# Altium schematic sheet MCU.SchDoc
size B
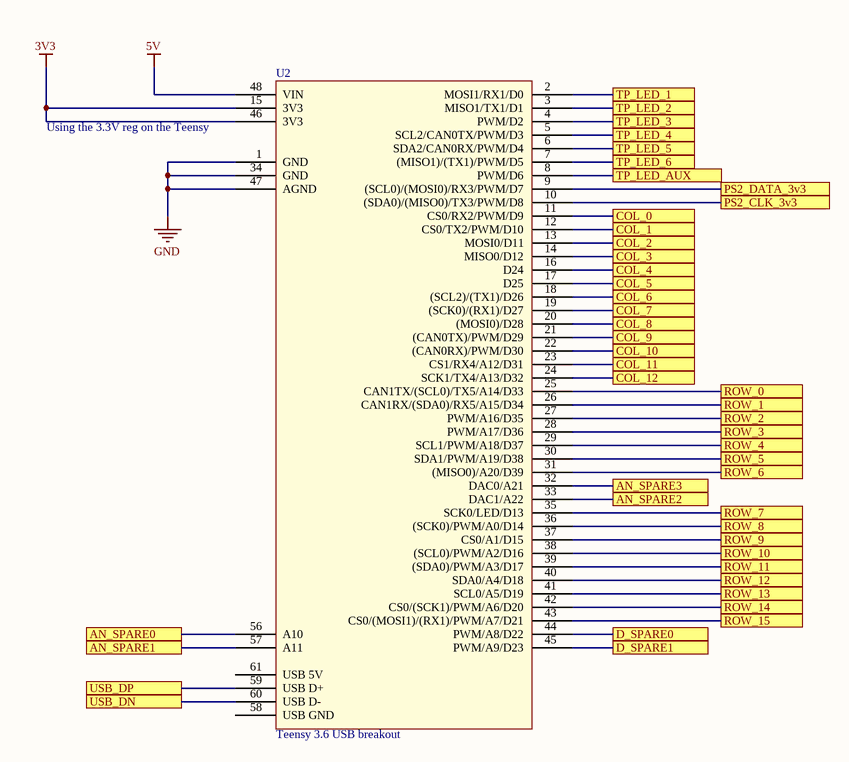
[diagram p0: MCU.SchDoc]

## Parts
U2  Teensy 3.6 USB breakout  [Teensy 3.6 - USB Breakout]

## Ports
AN_SPARE0, AN_SPARE1, AN_SPARE2, AN_SPARE3, COL_0, COL_1, COL_2, COL_3, COL_4, COL_5, COL_6, COL_7, COL_8, COL_9, COL_10, COL_11, COL_12, D_SPARE0, D_SPARE1, PS2_CLK_3v3, PS2_DATA_3v3, ROW_0, ROW_1, ROW_2, ROW_3, ROW_4, ROW_5, ROW_6, ROW_7, ROW_8, ROW_9, ROW_10, ROW_11, ROW_12, ROW_13, ROW_14, ROW_15, TP_LED_1, TP_LED_2, TP_LED_3, TP_LED_4, TP_LED_5, TP_LED_6, TP_LED_AUX, USB_DN, USB_DP

## Nets
3V3: U2.15(3V3) U2.46(3V3)
5V: U2.48(VIN)
GND: U2.1(GND) U2.34(GND) U2.47(AGND)
AN_SPARE0: U2.56(A10) ; port AN_SPARE0
AN_SPARE1: U2.57(A11) ; port AN_SPARE1
AN_SPARE2: U2.33(DAC1/A22) ; port AN_SPARE2
AN_SPARE3: U2.32(DAC0/A21) ; port AN_SPARE3
COL_0: U2.11(CS0/RX2/PWM/D9) ; port COL_0
COL_1: U2.12(CS0/TX2/PWM/D10) ; port COL_1
COL_2: U2.13(MOSI0/D11) ; port COL_2
COL_3: U2.14(MISO0/D12) ; port COL_3
COL_4: U2.16(D24) ; port COL_4
COL_5: U2.17(D25) ; port COL_5
COL_6: U2.18((SCL2)/(TX1)/D26) ; port COL_6
COL_7: U2.19((SCK0)/(RX1)/D27) ; port COL_7
COL_8: U2.20((MOSI0)/D28) ; port COL_8
COL_9: U2.21((CAN0TX)/PWM/D29) ; port COL_9
COL_10: U2.22((CAN0RX)/PWM/D30) ; port COL_10
COL_11: U2.23(CS1/RX4/A12/D31) ; port COL_11
COL_12: U2.24(SCK1/TX4/A13/D32) ; port COL_12
D_SPARE0: U2.44(PWM/A8/D22) ; port D_SPARE0
D_SPARE1: U2.45(PWM/A9/D23) ; port D_SPARE1
PS2_CLK_3v3: U2.10((SDA0)/(MISO0)/TX3/PWM/D8) ; port PS2_CLK_3v3
PS2_DATA_3v3: U2.9((SCL0)/(MOSI0)/RX3/PWM/D7) ; port PS2_DATA_3v3
ROW_0: U2.25(CAN1TX/(SCL0)/TX5/A14/D33) ; port ROW_0
ROW_1: U2.26(CAN1RX/(SDA0)/RX5/A15/D34) ; port ROW_1
ROW_2: U2.27(PWM/A16/D35) ; port ROW_2
ROW_3: U2.28(PWM/A17/D36) ; port ROW_3
ROW_4: U2.29(SCL1/PWM/A18/D37) ; port ROW_4
ROW_5: U2.30(SDA1/PWM/A19/D38) ; port ROW_5
ROW_6: U2.31((MISO0)/A20/D39) ; port ROW_6
ROW_7: U2.35(SCK0/LED/D13) ; port ROW_7
ROW_8: U2.36((SCK0)/PWM/A0/D14) ; port ROW_8
ROW_9: U2.37(CS0/A1/D15) ; port ROW_9
ROW_10: U2.38((SCL0)/PWM/A2/D16) ; port ROW_10
ROW_11: U2.39((SDA0)/PWM/A3/D17) ; port ROW_11
ROW_12: U2.40(SDA0/A4/D18) ; port ROW_12
ROW_13: U2.41(SCL0/A5/D19) ; port ROW_13
ROW_14: U2.42(CS0/(SCK1)/PWM/A6/D20) ; port ROW_14
ROW_15: U2.43(CS0/(MOSI1)/(RX1)/PWM/A7/D21) ; port ROW_15
TP_LED_1: U2.2(MOSI1/RX1/D0) ; port TP_LED_1
TP_LED_2: U2.3(MISO1/TX1/D1) ; port TP_LED_2
TP_LED_3: U2.4(PWM/D2) ; port TP_LED_3
TP_LED_4: U2.5(SCL2/CAN0TX/PWM/D3) ; port TP_LED_4
TP_LED_5: U2.6(SDA2/CAN0RX/PWM/D4) ; port TP_LED_5
TP_LED_6: U2.7((MISO1)/(TX1)/PWM/D5) ; port TP_LED_6
TP_LED_AUX: U2.8(PWM/D6) ; port TP_LED_AUX
USB_DN: U2.60(USB_D-) ; port USB_DN
USB_DP: U2.59(USB_D+) ; port USB_DP

Not connected (* = marked no-connect by the designer): U2 58(USB_GND) 61(USB_5V)

## Notes on the sheet
- (near U2) Using the 3.3V reg on the Teensy